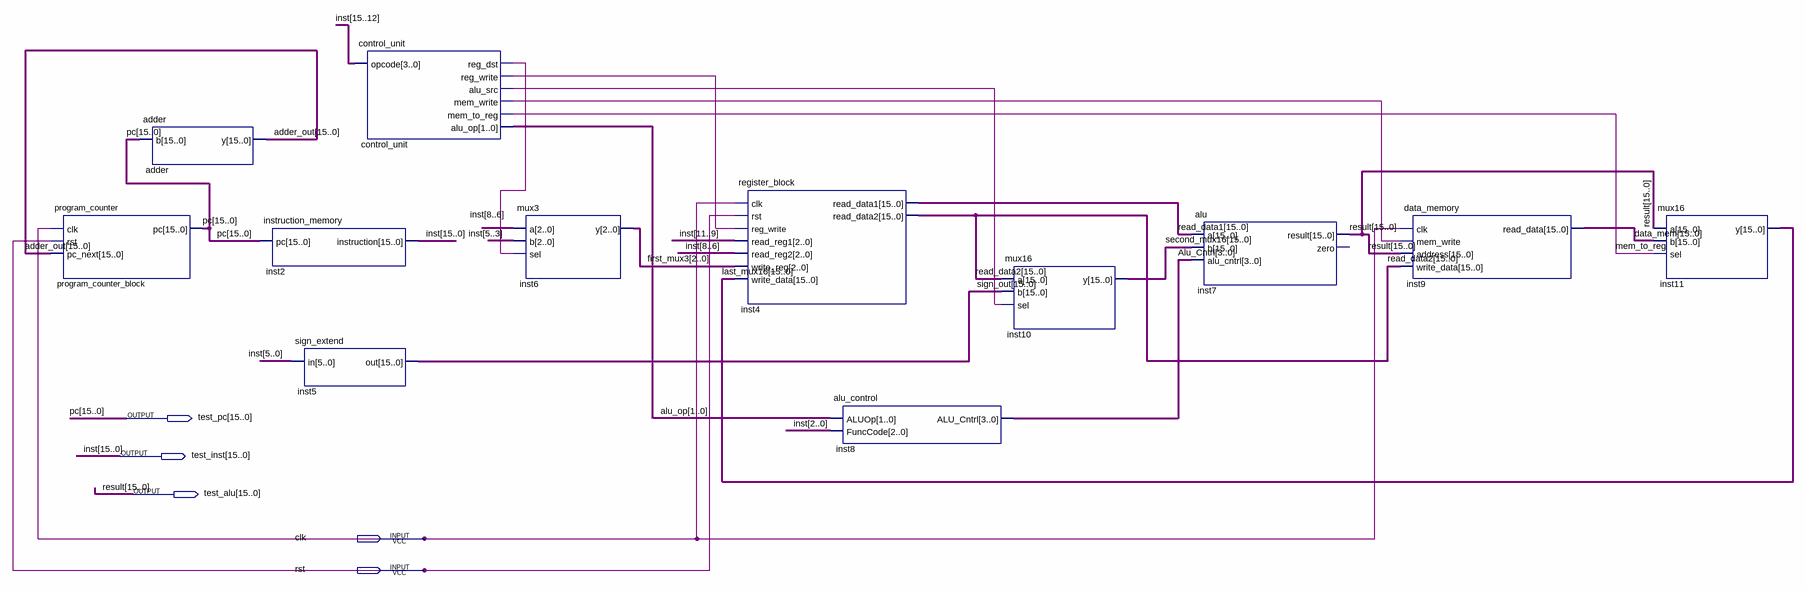
[diagram p0: schematic sheet]
// Quartus schematic singleCycle.bdf as structural Verilog: 12 symbols, 5 pins
module singleCycle (
  input  clk,
  input  rst,
  output [15:0] test_pc,
  output [15:0] test_inst,
  output [15:0] test_alu
);

  wire control_unit_alu_src, control_unit_mem_write, control_unit_reg_dst, control_unit_reg_write, mem_to_reg;
  wire [1:0] alu_op;
  wire [2:0] first_mux3;
  wire [3:0] Alu_Cntrl;
  wire [15:0] adder_out, data_mem, last_mux16, read_data1, read_data2, second_mux16, sign_out;

  program_counter program_counter_block (.clk(clk), .rst(rst), .pc_next(adder_out), .pc(test_pc));
  adder adder (.b(test_pc), .y(adder_out));
  instruction_memory inst2 (.pc(test_pc), .instruction(test_inst));
  sign_extend inst5 (.in(test_inst[5:0]), .out(sign_out));
  control_unit control_unit (
    .opcode(test_inst[15:12]), .reg_dst(control_unit_reg_dst), .reg_write(control_unit_reg_write),
    .alu_src(control_unit_alu_src), .mem_write(control_unit_mem_write), .mem_to_reg(mem_to_reg),
    .alu_op(alu_op));
  mux3 inst6 (.a(test_inst[8:6]), .b(test_inst[5:3]), .sel(control_unit_reg_dst), .y(first_mux3));
  register_block inst4 (
    .clk(clk), .rst(rst), .reg_write(control_unit_reg_write), .read_reg1(test_inst[11:9]),
    .read_reg2(test_inst[8:6]), .write_reg(first_mux3), .write_data(last_mux16), .read_data1(read_data1),
    .read_data2(read_data2));
  alu_control inst8 (.ALUOp(alu_op), .FuncCode(test_inst[2:0]), .ALU_Cntrl(Alu_Cntrl));
  mux16 inst10 (.a(read_data2), .b(sign_out), .sel(control_unit_alu_src), .y(second_mux16));
  alu inst7 (.a(read_data1), .b(second_mux16), .alu_cntrl(Alu_Cntrl), .result(test_alu));  // open: zero
  data_memory inst9 (
    .clk(clk), .mem_write(control_unit_mem_write), .address(test_alu), .write_data(read_data2),
    .read_data(data_mem));
  mux16 inst11 (.a(test_alu), .b(data_mem), .sel(mem_to_reg), .y(last_mux16));

  // Other names for the same wires on the sheet: inst[15:0] = test_inst; pc[15:0] = test_pc; result[15:0] = test_alu
endmodule
